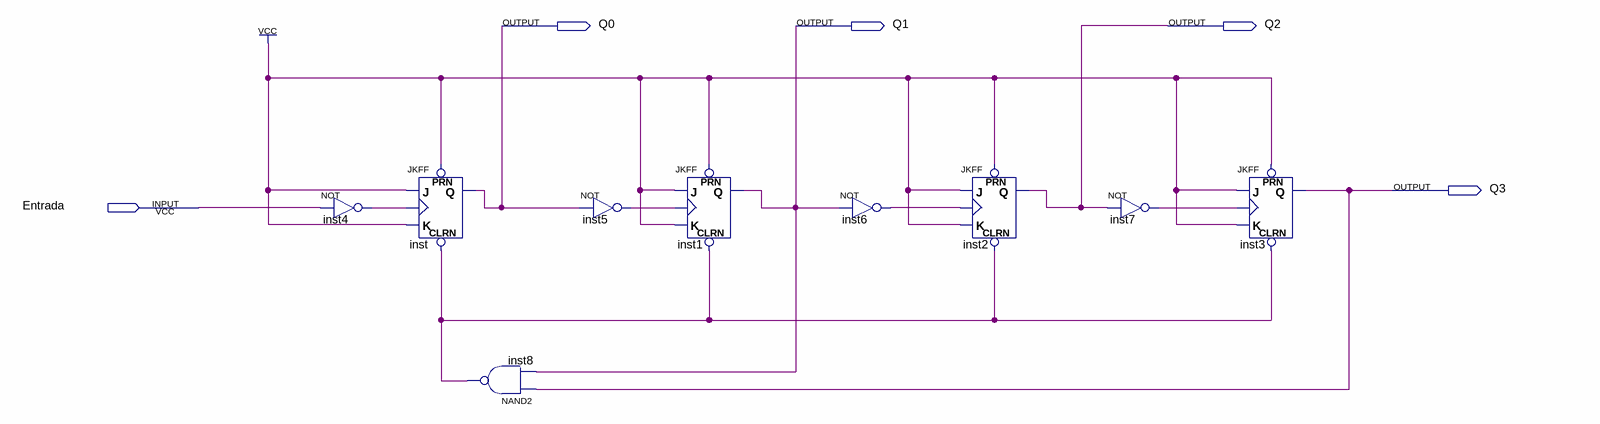
[diagram p0: schematic sheet]
// Quartus schematic Mod10.bdf as structural Verilog: 9 symbols, 5 pins
module Mod10 (
  input  Entrada,
  output Q0,
  output Q1,
  output Q2,
  output Q3
);

  wire inst4_out, inst5_out, inst6_out, inst7_out, inst8_out;

  not inst4 (inst4_out, Entrada);
  JKFF inst (.PRN(1'b1), .CLRN(inst8_out), .K(1'b1), .J(1'b1), .CLK(inst4_out), .Q(Q0));
  nand inst8 (inst8_out, Q3, Q1);
  not inst5 (inst5_out, Q0);
  JKFF inst1 (.PRN(1'b1), .CLRN(inst8_out), .K(1'b1), .J(1'b1), .CLK(inst5_out), .Q(Q1));
  not inst6 (inst6_out, Q1);
  JKFF inst2 (.PRN(1'b1), .CLRN(inst8_out), .K(1'b1), .J(1'b1), .CLK(inst6_out), .Q(Q2));
  not inst7 (inst7_out, Q2);
  JKFF inst3 (.PRN(1'b1), .CLRN(inst8_out), .K(1'b1), .J(1'b1), .CLK(inst7_out), .Q(Q3));
endmodule
